# EAGLE design magloop_ad8129 (EAGLE 9.6.2)
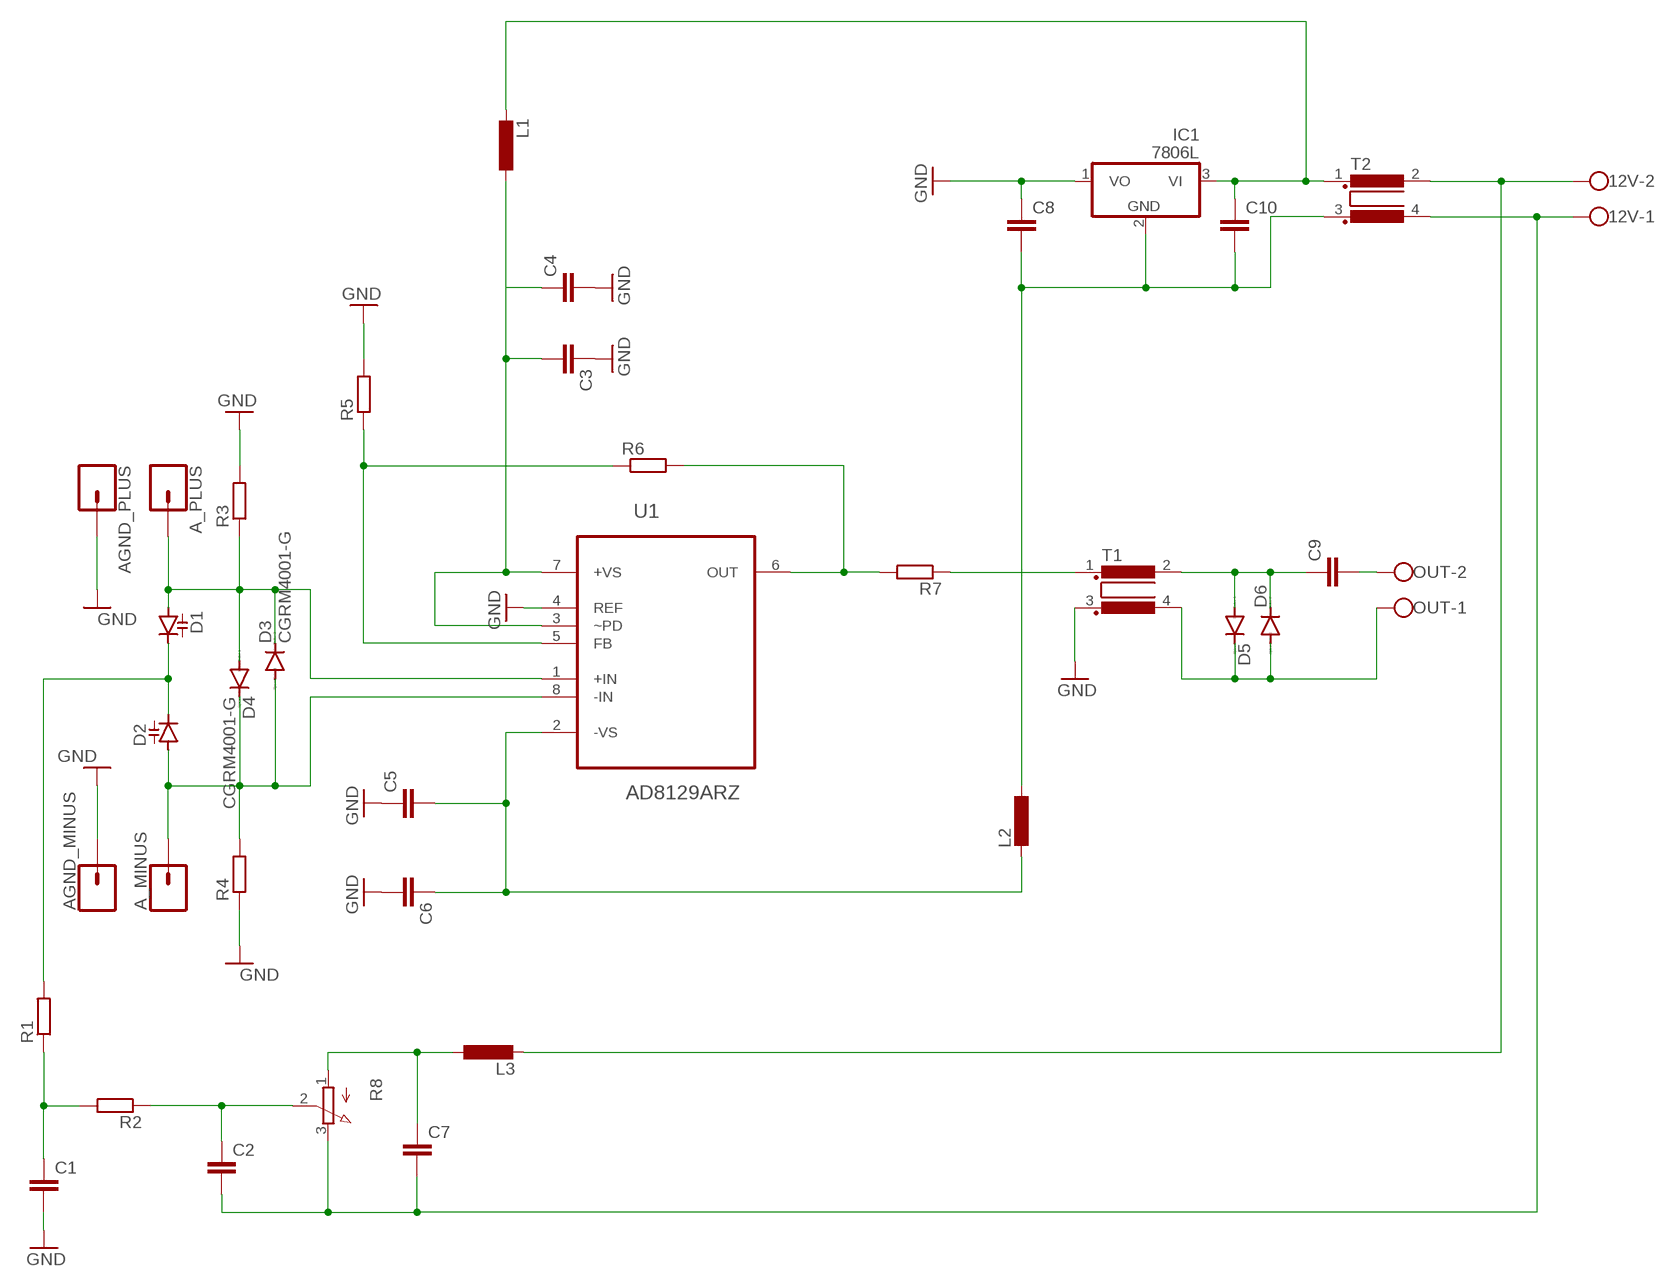
[diagram p0: schematic, sheet 1]

## Parts
12V  W237-102  [W237-102]
A_MINUS  CONN_01PTH_2MM  [1X01_2MM]
A_PLUS  CONN_01PTH_2MM  [1X01_2MM]
AGND_MINUS  CONN_01PTH_2MM  [1X01_2MM]
AGND_PLUS  CONN_01PTH_2MM  [1X01_2MM]
C1  C-EUC0805K  [C0805K]
C2  C-EUC0805K  [C0805K]
C3  C-EUC1206K  [C1206K]
C4  C-EUC1206K  [C1206K]
C5  C-EUC1206K  [C1206K]
C6  C-EUC1206K  [C1206K]
C7  C-EUC0805K  [C0805K]
C8  C-EUC1206K  [C1206K]
C9  C-EUC1206  [C1206]
C10  C-EUC1206K  [C1206K]
D1  DIODE_CAPACITANCE-SOT54H  [SOT54H]
D2  DIODE_CAPACITANCE-SOT54H  [SOT54H]
D3  CGRM4001-G  [SOD-123_MINI-SMA]
D4  CGRM4001-G  [SOD-123_MINI-SMA]
D5  CGRM4001-G  [SOD-123_MINI-SMA]
D6  CGRM4001-G  [SOD-123_MINI-SMA]
IC1  7806L  [TO92]
L1  L-EU0207/10  [0207/10]
L2  L-EU0207/10  [0207/10]
L3  L-EU0207/10  [0207/10]
OUT  W237-102  [W237-102]
R1  R-EU_R0805  [R0805]
R2  R-EU_R0805  [R0805]
R3  R-EU_R1206  [R1206]
R4  R-EU_R1206  [R1206]
R5  R-EU_R0805  [R0805]
R6  R-EU_R0805  [R0805]
R7  R-EU_R1206  [R1206]
R8  3RP/1610N  [3RP/1610N]
T1  R1405UB1/2  [B1/2]
T2  R1405UB1/2  [B1/2]
U1  AD8129ARZ  [SOIC127P600X175-8N]

## Nets
GND: AGND_MINUS.1 AGND_PLUS.1 C1.2 C3.1 C4.2 C5.1 C6.2 C8.1 IC1.1(VO) R3.2 R4.1 R5.2 T1.3 U1.4(REF)
N$1: A_PLUS.1 D1.A D3.C D4.A R3.1 U1.1(+IN)
N$2: D1.C D2.C R1.2
N$3: A_MINUS.1 D2.A D3.A D4.C R4.2 U1.8(-IN)
N$4: R5.1 R6.1 U1.5(FB)
N$5: R6.2 R7.2 U1.6(OUT)
N$6: C1.1 R1.1 R2.2
N$7: C2.1 R2.1 R8.2(S)
N$8: C7.1 L3.1 R8.1(A)
N$9: C3.2 C4.1 L1.1 U1.3(~PD) U1.7(+VS)
N$10: C10.1 IC1.3(VI) L1.2 T2.1
N$11: C8.2 C10.2 IC1.2(GND) L2.1 T2.3
N$12: 12V.2 L3.2 T2.2
N$13: 12V.1 C2.2 C7.2 R8.3(E) T2.4
N$14: C5.2 C6.1 L2.2 U1.2(-VS)
N$15: R7.1 T1.1
N$16: C9.1 D5.A D6.C T1.2
N$17: C9.2 OUT.2
N$18: D5.C D6.A OUT.1 T1.4

## Library data of the parts
12V OUT = con-wago-500:W237-102: WAGO SCREW CLAMP; MPN: 237-102; OC_FARNELL: unknown; OC_NEWARK: 70K9898
A_MINUS A_PLUS AGND_MINUS AGND_PLUS = SparkFun-Connectors:CONN_01: Single connection point. Often used as Generic Header-pin footprint for 0.1 inch spaced/style header connections On any of the 0.1 inch spaced packages, you can populate with these: Break Away Headers - Straight <https://www.sparkfun.com/products/116> (PRT-00116) Break Away Male Headers - Right Angle <https://www.sparkfun.com/products/553> (PRT-00553) Female Headers <https://www.sparkfun.com/products/115> (PRT-00115) Break Away Headers - Machine Pin <https://www.sparkfun.com/products/117> (PRT-00117) Break Away Female Headers - Swiss Machine Pin <https://www.sparkfun.com/products/743> (PRT-00743) This device is also useful as a general connection point to wire up your design to another part of your project. Our various solder wires solder well into these plated through hole pads. Hook-Up Wire - Assortment (Stranded, 22 AWG) <https://www.sparkfun.com/products/11375> (PRT-11375) Hook-Up Wire - Assortment (Solid Core, 22 AWG) <https://www.sparkfun.com/products/11367> (PRT-11367) View the entire wire category on our website here <https://www.sparkfun.com/categories/141> Special notes: SMTSO-256-ET is a "flush mount" nut for a 4-40 screw. We mostly use this on specialty testbeds; it is a nice way to connect hardware to your PCB at an adjustable hieght. Also note, the SNAP packages are for using a snappable style connector. We sell a baggie of snaps and they are also used on two LilyPad designs: Snap Assortment - 30 pack (male and female) <https://www.sparkfun.com/products/11347> (DEV-11347) LilyPad Arduino SimpleSnap <https://www.sparkfun.com/products/10941> (DEV-10941) LilyPad SimpleSnap Protoboard <https://www.sparkfun.com/products/10940> (DEV-10940)
C1-C10 = rcl_home_optimized:C-EU: CAPACITOR, European symbol; SPICEPREFIX: C
D1 D2 = diode:DIODE_CAPACITANCE-: Capacity DIODE
D3-D6 = diode:CGRM400*-G: Molded plasitc,JEDEC SOD-123/Mini SMA Source: Comchip CGRM4001-G.pdf
IC1 = linear:78*: Positive VOLTAGE REGULATOR Source: http://cache.national.com/ds/LM/LM78L05.pdf http://www.fairchildsemi.com/ds/LM/LM7805.pdf
L1-L3 = rcl_home_optimized:L-EU: INDUCTOR, European symbol; SPICEPREFIX: L
R1-R7 = rcl_home_optimized:R-EU_: RESISTOR, European symbol; SPICEPREFIX: R
R8 = pot:3RP/1610N: 16mm Potentiometer one level Source: http://www.alphapotentiometers.net/html/16mm_pot_2.html
T1 T2 = inductor-nkl:R1405U: Gleichtakt-Entstördrossel (über typ. 5MHz) common mode choke (above typ.5MHz); OC_FARNELL: unknown; OC_NEWARK: unknown
U1 = AD8129ARZ:AD8129ARZ: Low Cost 270 MHz Differential Receiver Amplifiers Check prices <https://pricing.snapeda.com/parts/AD8129ARZ/Analog%20Devices/view-part?ref=eda>; AVAILABILITY: In Stock; DESCRIPTION: Differential Amplifier 1 Circuit - 8-SOIC; MF: Analog Devices; MP: AD8129ARZ; PACKAGE: SOIC-8 Analog Devices; PRICE: None; PURCHASE-URL: https://pricing.snapeda.com/search/part/AD8129ARZ/?ref=eda

## Board
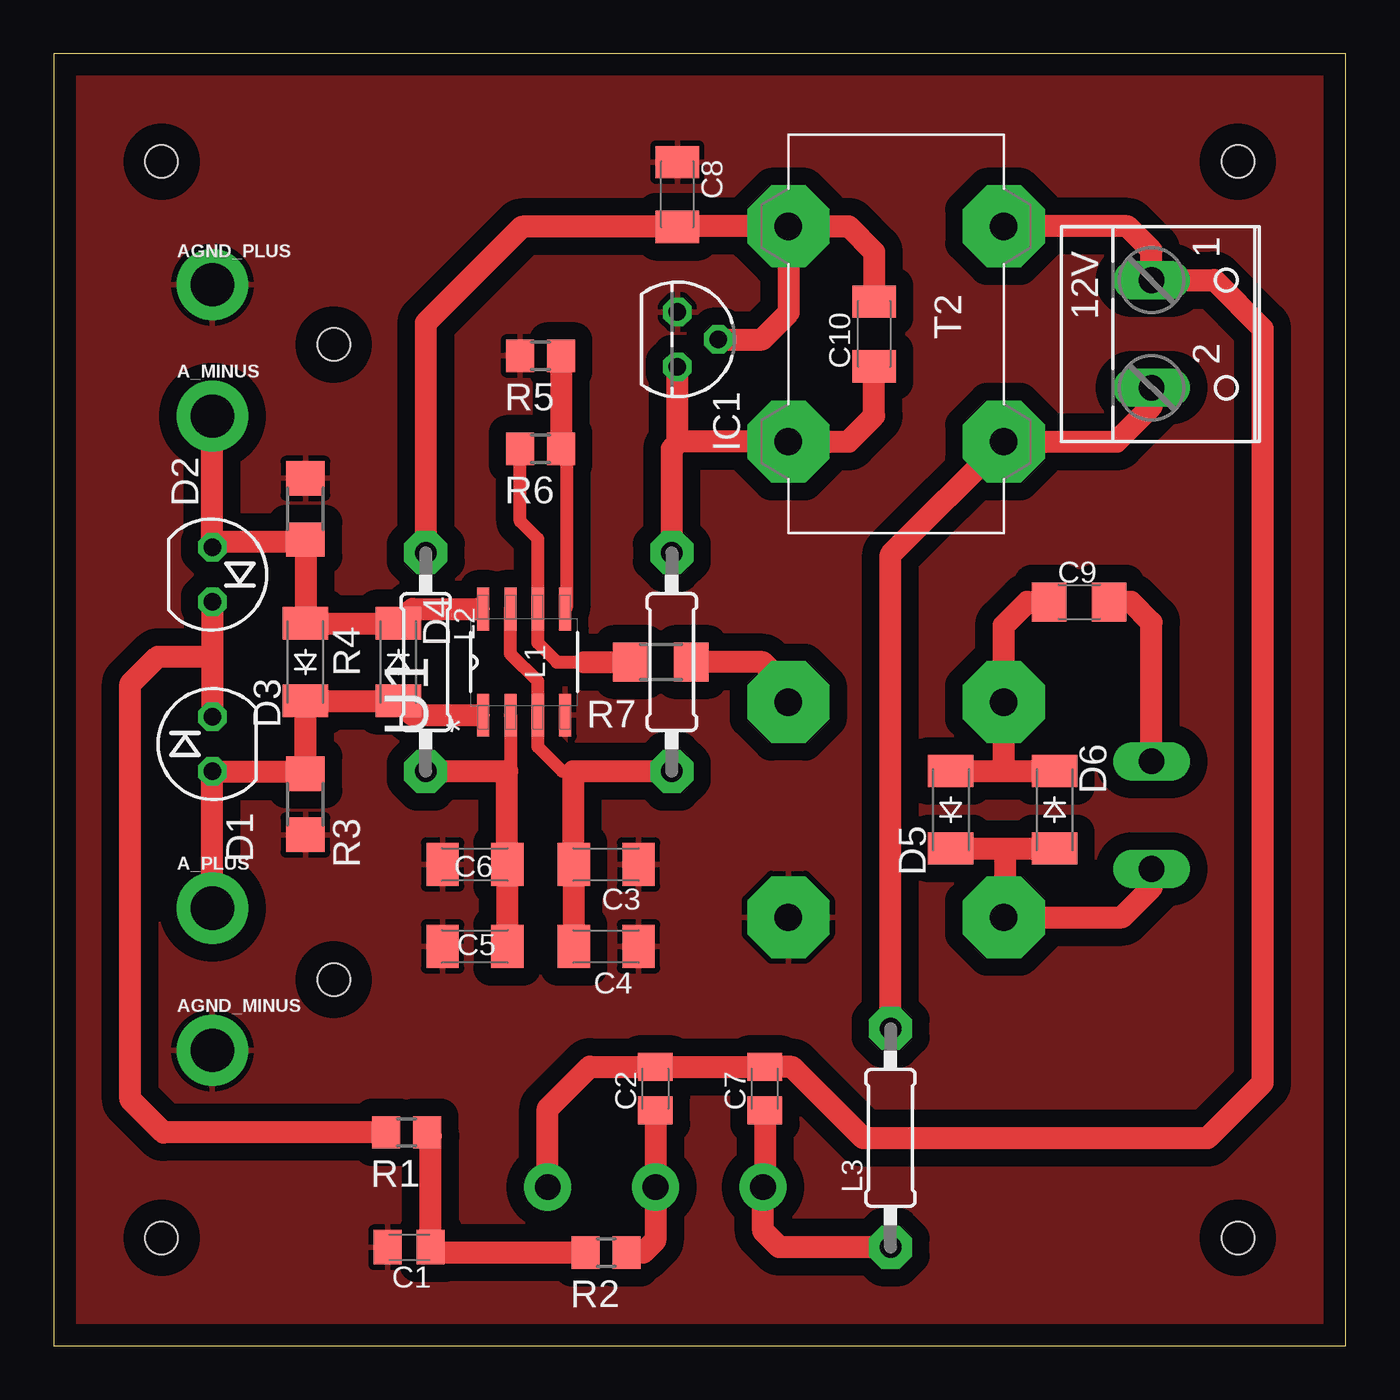
[diagram p1: board, top side]
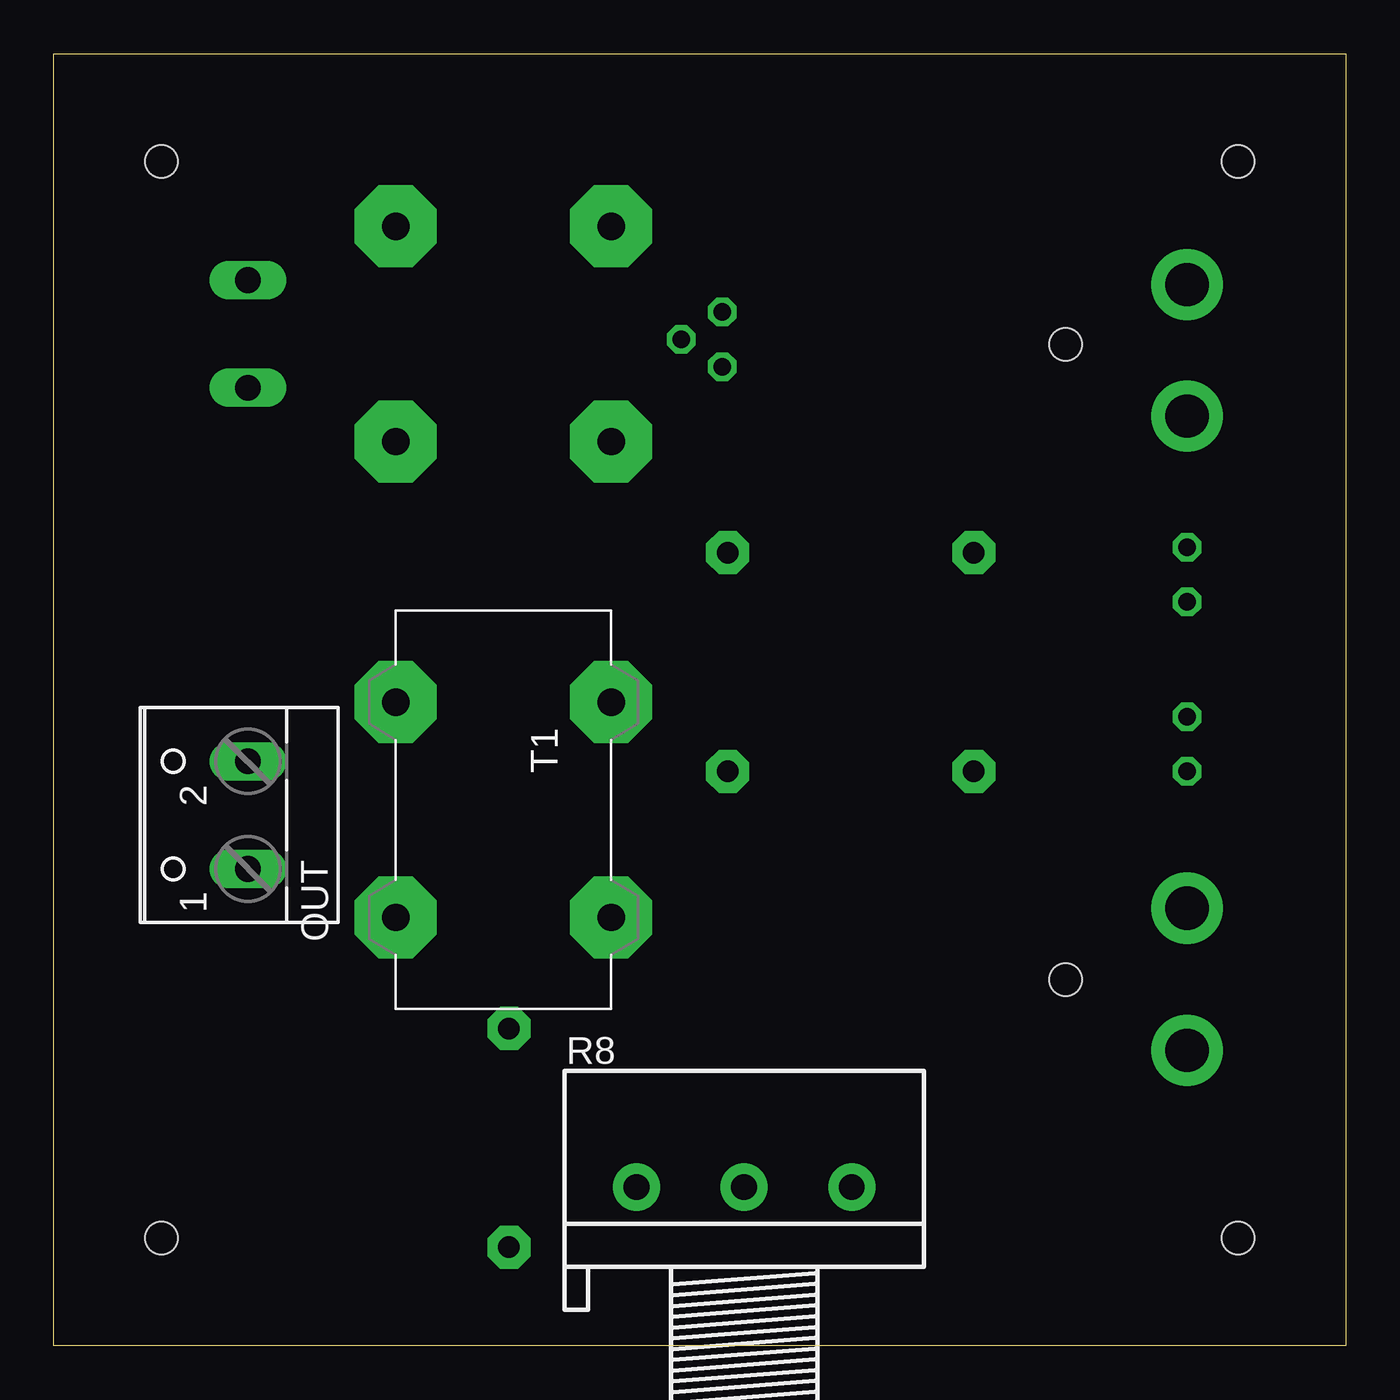
[diagram p2: board, bottom side, seen from below]

Size 60 x 60 mm. Coordinates in mm from the lower left corner, seen from the top.
Outline: 0,0 60,0 60,60 0,60 0,0
Copper layers (1*16): Top 0.035mm / dielectric 1.5mm / Bottom 0.035mm
Design rules "default": minimum track width 6mil, minimum drill 0.35mm, track to track 6mil, track to pad 6mil, pad to pad 6mil, via to via 6mil, smd to smd 6mil, copper to edge 40mil, drill to drill 6mil, minimum pad ring 10mil, minimum via ring 8mil, stop-mask expansion 4mil, vias tented up to drill 0mil, thermal gap 10mil
Holes 1.5 mm at 5,5 55,5 55,55 5,55 13,17 13,46.5

### Footprints (pad centres in the part's own frame; a part is rotated, then mirrored left to right if it is on the bottom)
W237-102 = drill 1.194 long: 1 -2.5,-1.27; 2 2.5,-1.27
1X01_2MM = drill 2 pad 3.302: 1 0,0
C0805K = smd 1.3 x 1.6: 1 -1,0; 2 1,0
C1206K = smd 1.5 x 2: 1 -1.5,0; 2 1.5,0
C1206 = smd 1.6 x 1.8: 1 -1.4,0; 2 1.4,0
SOT54H = drill 0.813 octagon: A 1.27,0; C -1.27,0
SOD-123_MINI-SMA = smd 1.5 x 2.1: A 1.8,0; C -1.8,0
TO92 = drill 0.813 octagon: 1 -1.27,0; 2 0,1.905; 3 1.27,0
0207/10 = drill 1 pad 2 octagon: 1 -5.08,0; 2 5.08,0
R0805 = smd 1.3 x 1.5: 1 -0.95,0; 2 0.95,0
R1206 = smd 1.6 x 1.803: 1 -1.422,0; 2 1.422,0
3RP/1610N = drill 1.2 pad 2.184: 1 -5,0; 2 0,0; 3 5,0
B1/2 = drill 1.27 pad 3.81 octagon: 1 -5,5; 2 -5,-5; 3 5,5; 4 5,-5
SOIC127P600X175-8N = smd 1.981 x 0.559: 1 -2.464,1.905; 2 -2.464,0.635; 3 -2.464,-0.635; 4 -2.464,-1.905; 5 2.464,-1.905; 6 2.464,-0.635; 7 2.464,0.635; 8 2.464,1.905

### Placement (x,y rotation side)
12V  52.25,46.99 270 top
A_MINUS  7.37,43.18 0 top
A_PLUS  7.37,20.32 0 top
AGND_MINUS  7.37,13.72 0 top
AGND_PLUS  7.37,49.28 0 top
C1  16.51,4.57 180 top
C2  27.94,11.94 90 top
C3  25.65,22.35 180 top
C4  25.65,18.54 0 top
C5  19.56,18.54 0 top
C6  19.56,22.35 180 top
C7  33.02,11.94 90 top
C8  28.96,53.47 270 top
C9  47.62,34.54 0 top
C10  38.1,46.99 90 top
D1  7.37,27.94 270 top
D2  7.37,35.81 90 top
D3  11.68,31.75 90 top
D4  16,31.75 270 top
D5  41.66,24.89 90 top
D6  46.48,24.89 270 top
IC1  28.96,46.74 270 top
L1  28.7,31.75 90 top
L2  17.27,31.75 270 top
L3  38.86,9.65 90 top
OUT  52.25,24.64 90 bottom
R1  16.38,9.91 180 top
R2  25.65,4.32 180 top
R3  11.68,25.15 270 top
R4  11.68,38.86 270 top
R5  22.61,45.97 180 top
R6  22.61,41.66 180 top
R7  28.19,31.75 180 top
R8  27.94,7.37 0 bottom
T1  39.12,24.89 270 bottom
T2  39.12,46.99 90 top
U1  21.84,31.75 90 top

### Tracks (layer width: path | path; a pad name or v marks a point on that pad's centre or on a via)
GND
  pour Top (isolate 0.813): -1.52,81.28 -1.52,-2.29 102.11,-2.29 102.11,81.28
N$1
  Top 0.61: U1.1 19.56,29.29 19.53,29.32
  Top 1.016: A_PLUS.1 D1.A 11.68,26.67 | R3.1 11.68,26.67 | 11.68,26.67 D3.C D4.A 16.67,29.29 19.56,29.29
N$2
  Top 1.016: R1.2 5.08,9.91 3.56,11.43 3.56,30.73 4.83,32 7.37,32 | D2.C 7.37,32 | 7.37,32 D1.C
N$3
  Top 0.61: U1.8 19.68,34.21 19.66,34.19
  Top 1.016: A_MINUS.1 D2.A 7.62,37.34 11.68,37.34 | R4.2 11.68,37.34 | 11.68,37.34 D3.A D4.C 16.67,34.21 19.68,34.21
N$4
  Top 0.61: U1.5 23.81,34.27 23.81,41.4 R6.1
  Top 1.016: R5.1 R6.1
N$5
  Top 0.61: R7.2 27.03,31.75 | 24.64,31.75 23.37,31.75 22.48,32.64 U1.6 22.48,37.47 21.66,38.29 R6.2
  Top 1.016: 24.64,31.75 R7.2
N$6
  Top 0.61: C1.1
  Top 1.016: R2.2 17.76,4.32 C1.1 17.51,9.73 R1.1
N$7
  Top 1.016: C2.1 R8.2 27.94,4.89 27.37,4.32 R2.1
N$8
  Top 1.016: C7.1 33.02,7.45 R8.1 32.94,5.33 33.7,4.57 L3.1
N$9
  Top 0.61: U1.7 21.21,32.13 22.48,30.86 U1.3 22.48,27.81 23.62,26.67 24.13,26.67
  Top 1.016: C3.2 24.13,22.38 24.13,26.67 L1.1 | C4.1 C3.2 | 24,22.5 C3.2
N$10
  Top 1.016: C10.1 38.1,43.18 36.91,41.99 T2.1 29.04,41.99 28.96,41.91 | L1.2 28.7,41.66 28.96,41.91 | 28.96,41.91 IC1.3
N$11
  Top 0.61: 33.2,51.08 T2.3
  Top 1.016: T2.3 36.91,51.99 38.1,50.8 C10.2 | IC1.2 32.89,46.74 34.14,47.98 34.14,51.97 T2.3 | T2.3 28.98,51.99 C8.2 21.74,51.97 17.27,47.5 L2.1
N$12
  Top 0.61: 42.67,41.99 T2.2
  Top 1.016: L3.2 38.86,36.74 T2.2 49.36,41.99 50.98,43.62 12V.2
N$13
  Top 0.61: C7.2 33.02,12.95
  Top 1.016: T2.4 49.86,51.99 50.98,50.87 12V.1 53.89,49.49 56.13,47.24 56.13,12.19 53.58,9.64 37.59,9.64 34.29,12.94 C7.2 C2.2 27.92,12.95 24.89,12.95 22.94,11 R8.3
N$14
  Top 0.61: 21.06,21.59 C6.1 21.06,22.63 | U1.2 21.21,26.67 20.83,26.67 20.8,26.67
  Top 1.016: C5.2 C6.1 21.06,26.67 20.83,26.67 | 20.8,26.67 L2.2
N$15
  Top 1.016: T1.1 34.12,30.55 32.92,31.75 R7.1
N$16
  Top 1.016: D5.A 44.2,26.69 | 44.2,26.69 D6.C | 44.2,26.69 44.12,26.77 T1.2 44.12,33.45 45.21,34.54 C9.1
N$17
  Top 1.016: OUT.2 50.98,33.6 50.04,34.54 C9.2
N$18
  Top 1.016: D5.C 44.2,23.09 | 44.2,23.09 D6.A | 44.2,23.09 44.2,19.97 T1.4 49.61,19.89 50.98,21.27 OUT.1